# EAGLE design pwerDevPack (EAGLE 8.0.1)
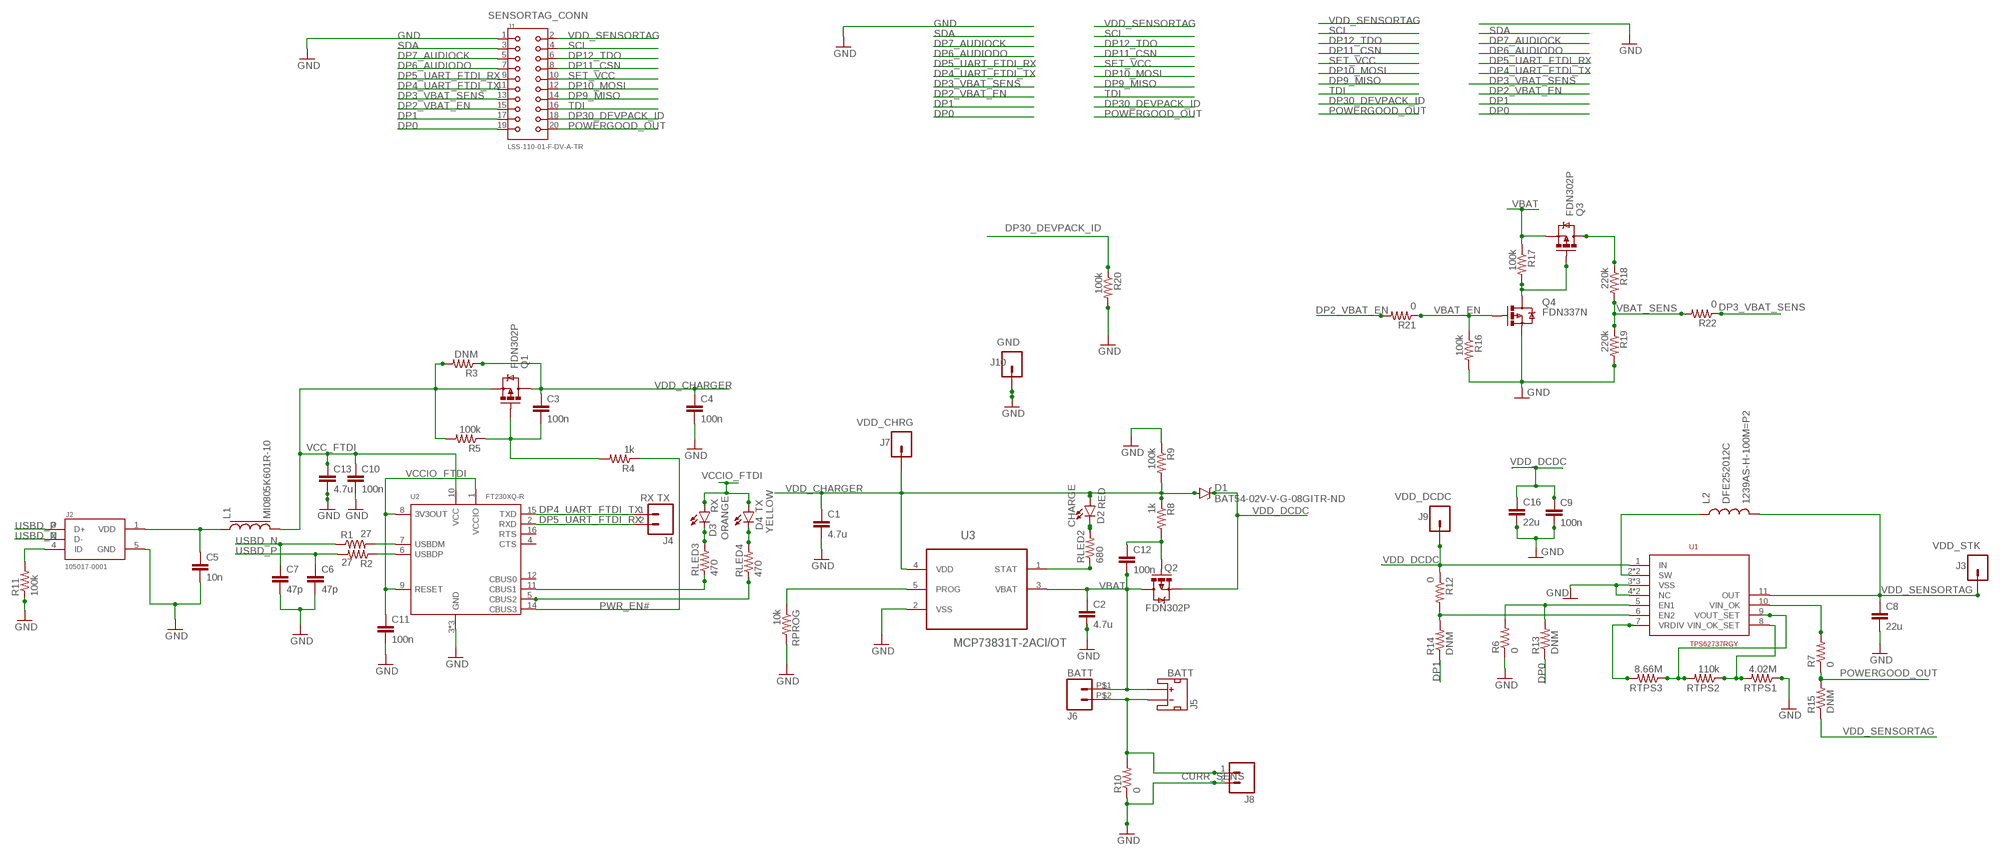
[diagram p0: schematic, sheet 1]

## Parts
C1  4.7u  CAP0603-CAP  [0603-CAP]
C2  4.7u  CAP0603-CAP  [0603-CAP]
C3  100n  CAP0603-CAP  [0603-CAP]
C4  100n  CAP0603-CAP  [0603-CAP]
C5  10n  CAP0603-CAP  [0603-CAP]
C6  47p  CAP0603-CAP  [0603-CAP]
C7  47p  CAP0603-CAP  [0603-CAP]
C8  22u  CAP0603-CAP  [0603-CAP]
C9  100n  CAP0603-CAP  [0603-CAP]
C10  100n  CAP0603-CAP  [0603-CAP]
C11  100n  CAP0603-CAP  [0603-CAP]
C12  100n  CAP0603-CAP  [0603-CAP]
C13  4.7u  CAP0603-CAP  [0603-CAP]
C16  22u  CAP0603-CAP  [0603-CAP]
D1  BAT54-02V-V-G-08GITR-ND  DIODE-SCHOTTKY-BAT54-2V  [SOD-523]
D2  RED  LED0603  [LED-0603]
D3  ORANGE  LED0603  [LED-0603]
D4  YELLOW  LED0603  [LED-0603]
J1  LSS-110-01-F-DV-A-TR  [SAMTEC_LSS-110-01-F-DV-A-TR]
J2  105017-0001  [MOLEX_105017-0001]
J3  M01PTH  [1X01]
J4  M02PTH  [1X02]
J5  S2B-PH-SM4-TB  JST_2MM_MALE  [JST-2-SMD]
J6  M02PTH2  [1X02_BIG]
J7  M01PTH  [1X01]
J8  M02PTH  [1X02]
J9  M01PTH  [1X01]
J10  M01PTH  [1X01]
L1  MI0805K601R-10  FERRITE_BREAD  [0805]
L2  1239AS-H-100M=P2  DFE252012C  [DFE252012C]
Q1  FDN302P  [SOT23-3]
Q2  FDN302P  [SOT23-3]
Q3  FDN302P  [SOT23-3]
Q4  FDN337N  [SOT23-3]
R1  27  RESISTOR0603-RES  [0603-RES]
R2  27  RESISTOR0603-RES  [0603-RES]
R3  DNM  RESISTOR0603-RES  [0603-RES]
R4  1k  RESISTOR0603-RES  [0603-RES]
R5  100k  RESISTOR0603-RES  [0603-RES]
R6  0  RESISTOR0603-RES  [0603-RES]
R7  0  RESISTOR0603-RES  [0603-RES]
R8  1k  RESISTOR0603-RES  [0603-RES]
R9  100k  RESISTOR0603-RES  [0603-RES]
R10  0  RESISTOR0603-RES  [0603-RES]
R11  100k  RESISTOR0603-RES  [0603-RES]
R12  0  RESISTOR0603-RES  [0603-RES]
R13  DNM  RESISTOR0603-RES  [0603-RES]
R14  DNM  RESISTOR0603-RES  [0603-RES]
R15  DNM  RESISTOR0603-RES  [0603-RES]
R16  100k  RESISTOR0603-RES  [0603-RES]
R17  100k  RESISTOR0603-RES  [0603-RES]
R18  220k  RESISTOR0603-RES  [0603-RES]
R19  220k  RESISTOR0603-RES  [0603-RES]
R20  100k  RESISTOR0603-RES  [0603-RES]
R21  0  RESISTOR0603-RES  [0603-RES]
R22  0  RESISTOR0603-RES  [0603-RES]
RLED2  680  RESISTOR0603-RES  [0603-RES]
RLED3  470  RESISTOR0603-RES  [0603-RES]
RLED4  470  RESISTOR0603-RES  [0603-RES]
RPROG  10k  RESISTOR0603-RES  [0603-RES]
RTPS1  4.02M  RESISTOR0603-RES  [0603-RES]
RTPS2  110k  RESISTOR0603-RES  [0603-RES]
RTPS3  8.66M  RESISTOR0603-RES  [0603-RES]
U1  TPS62737RGY  [QFN14]
U2  FT230XQ-R  FT230XQ_2  [QFN16]
U3  MCP73831T-2ACI/OT  [SOT95P280X145-5N]

## Nets
CHARGER_STAT: RLED2.1 U3.1(STAT)
DP0: J1.19 R13.1
DP1: J1.17 R14.1
DP2_VBAT_EN: J1.15 R21.2
DP3_VBAT_SENS: J1.13 R22.1
DP4_UART_FTDI_TX: J1.11 J4.1 U2.15(TXD)
DP5_UART_FTDI_RX: J1.9 J4.2 U2.2(RXD)
DP6_AUDIODO: J1.7
DP7_AUDIOCK: J1.5
DP9_MISO: J1.14
DP10_MOSI: J1.12
DP11_CSN: J1.8
DP12_TDO: J1.6
DP30_DEVPACK_ID: J1.18 R20.1
GND: C1.2 C2.2 C4.2 C5.2 C6.2 C7.2 C8.2 C9.2 C10.2 C11.2 C13.2 C16.2 J1.1 J2.5(GND) J8.2 J10.1 Q4.2(S) R6.1 R9.1 R10.1 R11.1 R16.2 R19.2 R20.2 RPROG.2 RTPS1.1 U1.3(VSS) U1.4(NC) U1.12(VSS) U1.14(NC) U1.TH_PAD(VSS) U2.3(GND) U2.13(GND) U2.17(GND) U3.2(VSS)
GND_BAT: J5.1(-) J6.P$2 J8.1 R10.2
N$1: D3.C RLED3.2
N$2: C5.1 J2.1(VDD) L1.1
N$3: C3.2 Q1.1(G) R4.2 R5.1
N$4: RTPS1.2 RTPS2.1 U1.8(VIN_OK_SET)
N$6: R6.2 R13.2 U1.5(EN1)
N$8: RPROG.1 U3.5(PROG)
N$9: Q3.3(D) R18.1
N$10: R12.2 R14.2 U1.6(EN2)
N$11: L2.P$1 U1.2(SW) U1.13(SW)
N$12: C12.1 Q2.1(G) R8.2
N$13: D2.C RLED2.2
N$14: D4.C RLED4.2
N$15: Q3.1(G) Q4.3(D) R17.2
N$18: J2.4(ID) R11.2
N$20: RLED3.1 U2.11(CBUS1)
N$21: R7.2 U1.10(VIN_OK)
N$22: RTPS3.2 U1.7(VRDIV)
N$24: RLED4.1 U2.5(CBUS2)
N$26: RTPS2.2 RTPS3.1 U1.9(VOUT_SET)
POWERGOOD_OUT: J1.20 R7.1 R15.2
PWR_EN#: R4.1 U2.14(CBUS3)
SCL: J1.4
SDA: J1.3
SET_VCC: J1.10
TDI: J1.16
USBD_N: C7.1 J2.2(D-) R1.1
USBD_P: C6.1 J2.3(D+) R2.2
USBDR_N: R1.2 U2.7(USBDM)
USBDR_P: R2.1 U2.6(USBDP)
VBAT: C2.1 C12.2 J5.2(+) J6.P$1 Q2.3(D) Q3.2(S) R17.1 U3.3(VBAT)
VBAT_EN: Q4.1(G) R16.1 R21.1
VBAT_SENS: R18.2 R19.1 R22.2
VCC_FTDI: C10.1 C13.1 L1.2 Q1.2(S) R3.2 R5.2 U2.10(VCC)
VCCIO_FTDI: C11.1 D3.A D4.A U2.1(VCCIO) U2.8(3V3OUT) U2.9(RESET)
VDD_CHARGER: C1.1 C3.1 C4.1 D1.A D2.A J7.1 Q1.3(D) R3.1 R8.1 R9.2 U3.4(VDD)
VDD_DCDC: C9.1 C16.1 D1.C J9.1 Q2.2(S) R12.1 U1.1(IN)
VDD_SENSORTAG: C8.1 J1.2 J3.1 L2.P$2 R15.1 U1.11(OUT)
Unconnected: J5.NC1(PAD1) J5.NC2(PAD2) U2.4(CTS) U2.12(CBUS0) U2.16(RTS)

## Library data of the parts
C1-C13 C16 = SparkFun-Capacitors:CAP: Capacitor Standard 0603 ceramic capacitor, and 0.1" leaded capacitor.
D1 = SparkFun-DiscreteSemi:DIODE-SCHOTTKY: Schottky diodes in SFE's production catalog BAT20J 1A 23V 0.62Vf RB751 120mA 40V 0.37Vf PMEG4005EJ 0.5A 40V 0.42Vf MBRA140 1A 40V 0.5Vf B340A 3A 40V SMA; VALUE: BAT54-2V
D2 = SparkFun-LED:LED: LEDs Standard schematic elements and footprints for 5mm, 3mm, 1206, and 0603 sized LEDs. 5mm - Spark Fun Electronics SKU : COM-00529 (and others); COLOR: RED; FUNCTION: CHARGE
D3 = SparkFun-LED:LED: LEDs Standard schematic elements and footprints for 5mm, 3mm, 1206, and 0603 sized LEDs. 5mm - Spark Fun Electronics SKU : COM-00529 (and others); COLOR: ORANGE; FUNCTION: RX
D4 = SparkFun-LED:LED: LEDs Standard schematic elements and footprints for 5mm, 3mm, 1206, and 0603 sized LEDs. 5mm - Spark Fun Electronics SKU : COM-00529 (and others); COLOR: YELLOW; FUNCTION: TX
J1 = LSS-110-01-F-DV-A-TR:LSS-110-01-F-DV-A-TR: Conn Socket and Terminal Strip SKT/HDR 20 POS 0.635mm Solder ST SMD T/R; AVAILABILITY: Warning; DESCRIPTION: Conn Socket and Terminal Strip SKT/HDR 20 POS 0.635mm Solder ST SMD T/R; LABEL: SENSORTAG_CONN; MF: Samtec; MP: LSS-110-01-F-DV-A-TR; PACKAGE: None; PRICE: 1.50 USD
J2 = 105017-0001:105017-0001; AVAILABILITY: Good; DESCRIPTION: Conn USB Type B M 5 POS 0.65mm Solder RA Thru-Hole 5 Terminal 1 Port Embossed T/R; MF: Molex; MP: 105017-0001; PACKAGE: None; PRICE: 0.49 USD
J3 = SparkFun-Connectors:M01: Header 1 Standard 1-pin 0.1" header. Use with straight break away headers (SKU : PRT-00116), right angle break away headers (PRT-00553), swiss pins (PRT-00743), machine pins (PRT-00117), and female headers (PRT-00115). SMTSO-256-ET is a "flush mount" nut for a 4-40 screw. The older package used to be too tight, and did not allow it to sit properly thru the drill hit. The latest (0.165DIA) fits nice and snug.; LABEL: VDD_STK
J4 = SparkFun-Connectors:M02: Standard 2-pin 0.1" header. Use with - straight break away headers ( PRT-00116) - right angle break away headers (PRT-00553) - swiss pins (PRT-00743) - machine pins (PRT-00117) - female headers (PRT-00115) Molex polarized connector foot print use with: PRT-08233 with associated crimp pins and housings. 2.54_SCREWTERM for use with PRT-10571. 3.5mm Screw Terminal footprints for PRT-08084 5mm Screw Terminal footprints for use with PRT-08432; LABEL: RX TX
J5 = SparkFun-Connectors:JST_2MM_MALE: Mates to single-cell LiPo batteries. CONN-11443 Now with smashable polarity marks!; BTM_NEG: -; BTM_POS: +; LABEL: BATT; PROD_ID: CONN-11443; TOP_NEG: -; TOP_POS: +
J6 = SparkFun-Connectors:M02: Standard 2-pin 0.1" header. Use with - straight break away headers ( PRT-00116) - right angle break away headers (PRT-00553) - swiss pins (PRT-00743) - machine pins (PRT-00117) - female headers (PRT-00115) Molex polarized connector foot print use with: PRT-08233 with associated crimp pins and housings. 2.54_SCREWTERM for use with PRT-10571. 3.5mm Screw Terminal footprints for PRT-08084 5mm Screw Terminal footprints for use with PRT-08432; LABEL: BATT
J7 = SparkFun-Connectors:M01: Header 1 Standard 1-pin 0.1" header. Use with straight break away headers (SKU : PRT-00116), right angle break away headers (PRT-00553), swiss pins (PRT-00743), machine pins (PRT-00117), and female headers (PRT-00115). SMTSO-256-ET is a "flush mount" nut for a 4-40 screw. The older package used to be too tight, and did not allow it to sit properly thru the drill hit. The latest (0.165DIA) fits nice and snug.; LABEL: VDD_CHRG
J8 = SparkFun-Connectors:M02: Standard 2-pin 0.1" header. Use with - straight break away headers ( PRT-00116) - right angle break away headers (PRT-00553) - swiss pins (PRT-00743) - machine pins (PRT-00117) - female headers (PRT-00115) Molex polarized connector foot print use with: PRT-08233 with associated crimp pins and housings. 2.54_SCREWTERM for use with PRT-10571. 3.5mm Screw Terminal footprints for PRT-08084 5mm Screw Terminal footprints for use with PRT-08432; LABEL: CURR_SENS
J9 = SparkFun-Connectors:M01: Header 1 Standard 1-pin 0.1" header. Use with straight break away headers (SKU : PRT-00116), right angle break away headers (PRT-00553), swiss pins (PRT-00743), machine pins (PRT-00117), and female headers (PRT-00115). SMTSO-256-ET is a "flush mount" nut for a 4-40 screw. The older package used to be too tight, and did not allow it to sit properly thru the drill hit. The latest (0.165DIA) fits nice and snug.; LABEL: VDD_DCDC
J10 = SparkFun-Connectors:M01: Header 1 Standard 1-pin 0.1" header. Use with straight break away headers (SKU : PRT-00116), right angle break away headers (PRT-00553), swiss pins (PRT-00743), machine pins (PRT-00117), and female headers (PRT-00115). SMTSO-256-ET is a "flush mount" nut for a 4-40 screw. The older package used to be too tight, and did not allow it to sit properly thru the drill hit. The latest (0.165DIA) fits nice and snug.; LABEL: GND
L1 = davide:FERRITE_BREAD
L2 = davide:DFE252012C; MODEL: DFE252012C
Q1-Q3 = davide:FDN302P
Q4 = davide:FDN337N
R1-R5 R8-R11 R16-R20 RLED2-RLED4 RPROG = SparkFun-Passives:RESISTOR: Resistor Basic schematic elements and footprints for 0603, 1206, and PTH resistors.
R6 R7 R12-R15 R21 R22 RTPS1-RTPS3 = SparkFun-Resistors:RESISTOR: Resistor Basic schematic elements and footprints for 0603, 1206, and PTH resistors.
U1 = davide:TPS62737RGY
U2 = FT230XQ:FT230XQ_2
U3 = MCP73831T-2ACI_OT:MCP73831T-2ACI/OT: Charge Management Controller; AVAILABILITY: Good; DESCRIPTION: MCP73831 Series Single-Cell Li-Ion/Li-Polymer Battery Charge Controller SOT-23-5; MF: Microchip; MP: MCP73831T-2ACI/OT; PACKAGE: SOT-23 Microchip; PRICE: 0.51 USD

## Board
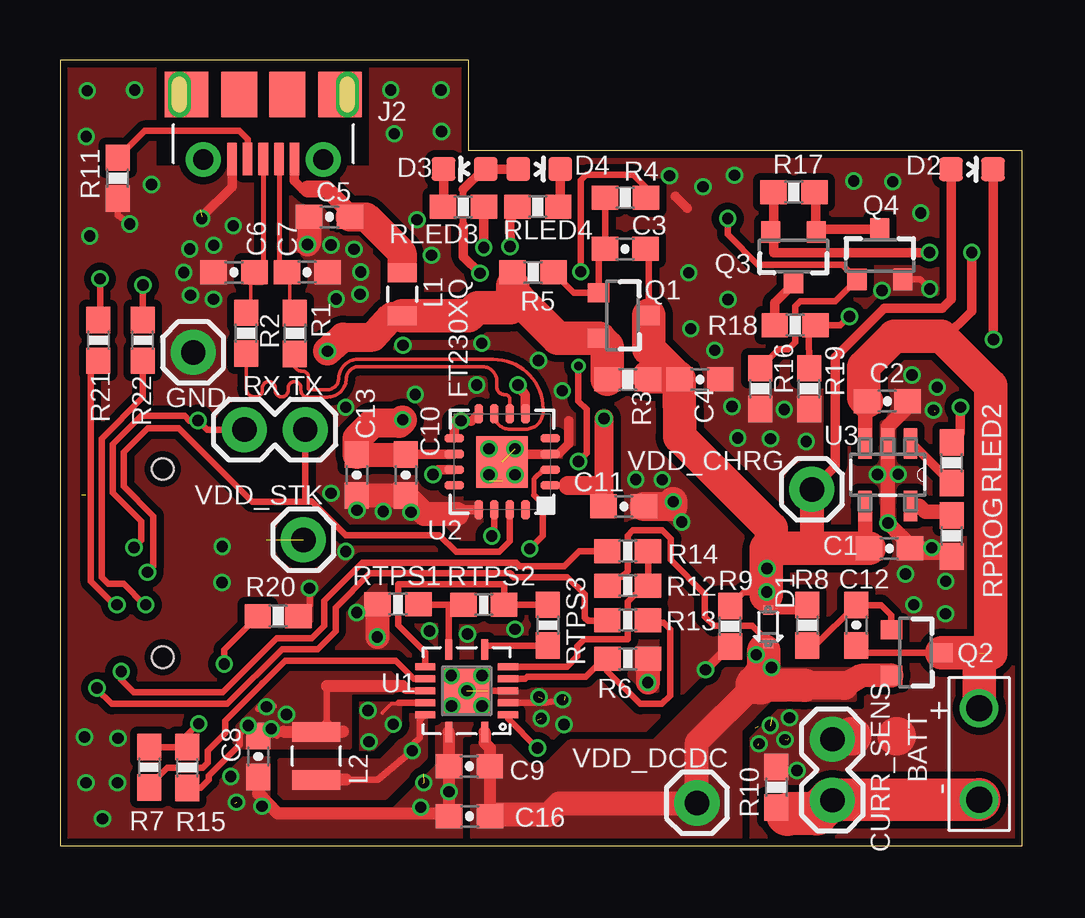
[diagram p1: board, top side]
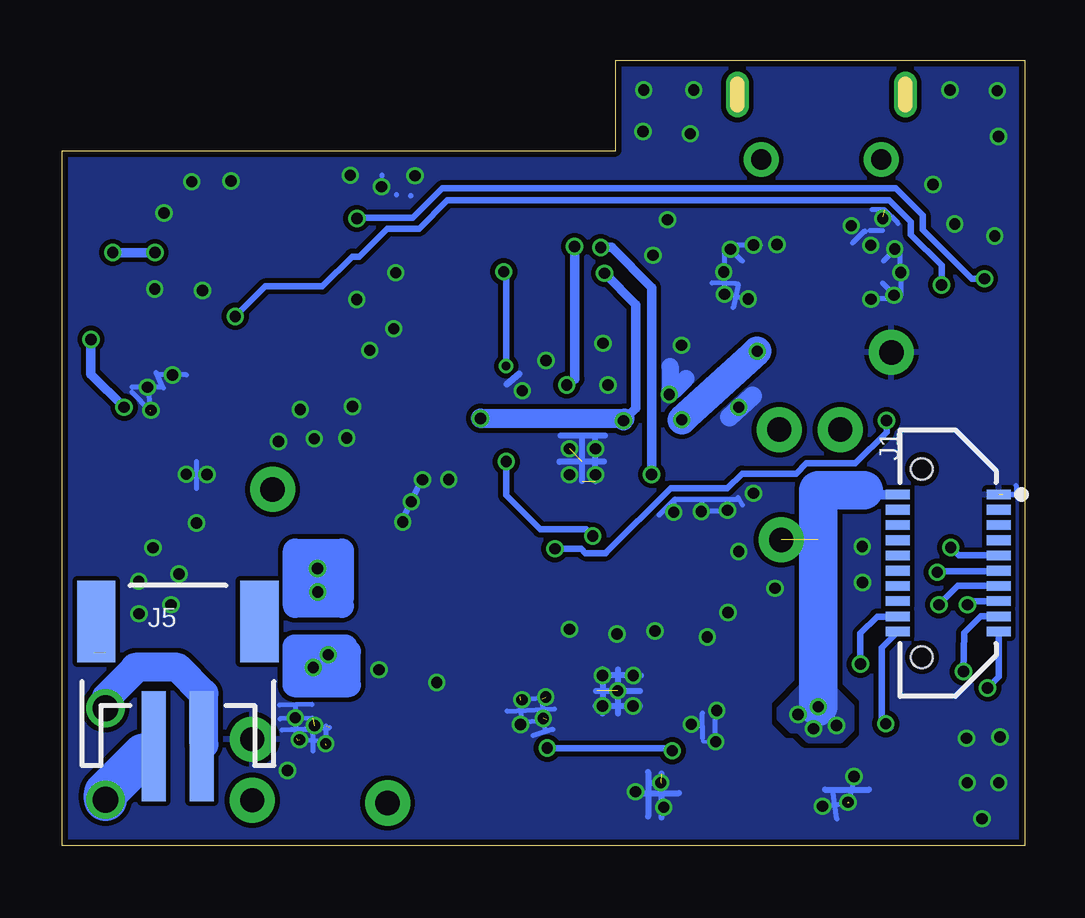
[diagram p2: board, bottom side, seen from below]

Size 40.09 x 32.74 mm. Coordinates in mm from the lower left corner, seen from the top.
Outline: 0,0 40.09,0 40.09,28.97 17.03,28.97 17.03,32.74 0,32.74 0,0
Copper layers (1*16): Top 0.018mm / dielectric 1.55mm / Bottom 0.018mm
Design rules "eC_2Layer_PClass6_BaseCopperO18_eCDefault": minimum track width 0.15mm, minimum drill 0.35mm, track to track 0.15mm, track to pad 0.15mm, pad to pad 0.15mm, via to via 0.15mm, smd to smd 0mil, copper to edge 0.25mm, drill to drill 0.35mm, minimum pad ring 0.175mm, minimum via ring 0.125mm, stop-mask expansion 0mil, vias tented up to drill 0.45mm, thermal gap 0.2mm

### Footprints (pad centres in the part's own frame; a part is rotated, then mirrored left to right if it is on the bottom)
0603-CAP = smd 1.1 x 1: 1 -0.85,0; 2 0.85,0
SOD-523 = smd 0.4 x 0.4: A -0.7,0; C 0.7,0
LED-0603 = smd 1 x 1: A 0,-0.877; C 0,0.877
SAMTEC_LSS-110-01-F-DV-A-TR = smd 0.4 x 1: 1 -2.857,2.1; 2 -2.857,-2.1; 3 -2.223,2.1; 4 -2.223,-2.1; 5 -1.587,2.1; 6 -1.587,-2.1; 7 -0.953,2.1; 8 -0.953,-2.1; 9 -0.318,2.1; 10 -0.318,-2.1; 11 0.318,2.1; 12 0.318,-2.1; 13 0.953,2.1; 14 0.953,-2.1; 15 1.587,2.1; 16 1.587,-2.1; 17 2.223,2.1; 18 2.223,-2.1; 19 2.857,2.1; 20 2.857,-2.1 | hole 0.89: 3.925,-1.1; -3.925,-1.1
MOLEX_105017-0001 = smd 0.4 x 1.35: 1 -1.3,2.675; 2 -0.65,2.675; 3 0,2.675; 4 0.65,2.675; 5 1.3,2.675 | drill 0.85 pad 1.45: P$1 -2.5,2.7; P$2 2.5,2.7 | smd 1.5 x 1.9: P$8 -1,0; P$9 1,0 | smd 1.8 x 1.9: P$10 -3.2,0; P$11 3.2,0 | drill 0.6 pad 0.9 long: P$12 -3.5,0; P$13 3.5,0
1X01 = drill 1.016 pad 1.88: 1 0,0
1X02 = drill 1.016 pad 1.88: 1 0,0; 2 2.54,0
JST-2-SMD = smd 1 x 4.6: 1 -1,-3.7; 2 1,-3.7 | smd 1.6 x 3.4: NC1 -3.4,1.5; NC2 3.4,1.5
1X02_BIG = drill 1.067: P$1 0,0; P$2 3.81,0
0805 = smd 0.8 x 1.2: 1 -0.9,0; 2 0.9,0
DFE252012C = smd 0.8 x 2: P$1 -1,0; P$2 1,0
SOT23-3 = smd 0.8 x 0.9: 1 -0.95,-1; 2 0.95,-1; 3 0,1.1
0603-RES = smd 1.1 x 1: 1 -0.85,0; 2 0.85,0
QFN14 = smd 0.85 x 0.28: 1 -1.725,-0.75; 7 1.725,-0.75; 8 1.725,0.75; 14 -1.725,0.75 | smd 0.28 x 0.85: 2 -1,-1.725; 3 -0.5,-1.725; 4 0,-1.725; 5 0.5,-1.725; 6 1,-1.725; 9 1,1.725; 10 0.5,1.725; 11 0,1.725; 12 -0.5,1.725; 13 -1,1.725 | smd 2 x 2: TH_PAD 0,0
QFN16 = smd 0.8 x 0.35: 1 -2,0.975; 2 -2,0.325; 3 -2,-0.325; 4 -2,-0.975; 9 2,-0.975; 10 2,-0.325; 11 2,0.325; 12 2,0.975 | smd 0.35 x 0.8: 5 -0.975,-2; 6 -0.325,-2; 7 0.325,-2; 8 0.975,-2; 13 0.975,2; 14 0.325,2; 15 -0.325,2; 16 -0.975,2 | smd 2.15 x 2.15: 17 0,0
SOT95P280X145-5N = smd 1.27 x 0.559: 1 -1.295,0.94; 2 -1.295,0; 3 -1.295,-0.94; 4 1.295,-0.94; 5 1.295,0.94

### Placement (x,y rotation side)
C1  34.56,12.39 0 top
C2  34.47,18.52 0 top
C3  23.55,24.87 180 top
C4  26.66,19.43 0 top
C5  11.23,26.21 180 top
C6  7.25,23.9 180 top
C7  10.3,23.9 0 top
C8  8.26,3.72 270 top
C9  17.05,3.31 180 top
C10  14.41,15.45 270 top
C11  23.49,14.14 0 top
C12  33.18,9.19 270 top
C13  12.37,15.45 270 top
C16  17.07,1.23 180 top
D1  29.51,9.13 270 top
D2  38,28.19 270 top
D3  16.86,28.2 90 top
D4  19.97,28.2 270 top
J1  3.18,11.78 270 bottom
J2  8.47,31.3 180 top
J3  10.14,12.75 0 top
J4  10.22,17.34 180 top
J5  35.28,7.85 0 bottom
J6  38.3,5.73 270 top
J7  31.33,14.85 0 top
J8  32.18,1.9 90 top
J9  26.54,1.78 90 top
J10  5.55,20.56 0 top
L1  14.26,22.98 270 top
L2  10.68,3.74 90 top
Q1  23.44,22.1 270 top
Q2  35.64,8.05 270 top
Q3  30.56,24.57 180 top
Q4  34.16,24.6 0 top
R1  9.79,21.35 270 top
R2  7.76,21.36 90 top
R3  23.65,19.43 180 top
R4  23.56,27.01 180 top
R5  19.71,23.9 180 top
R6  23.66,7.79 180 top
R7  3.71,3.27 270 top
R8  31.14,9.19 270 top
R9  27.92,9.15 90 top
R10  29.85,2.44 270 top
R11  2.41,27.82 90 top
R12  23.66,10.84 0 top
R13  23.65,9.4 0 top
R14  23.65,12.28 0 top
R15  5.31,3.26 90 top
R16  29.17,19.05 270 top
R17  30.58,27.24 0 top
R18  30.63,21.69 0 top
R19  31.21,19.05 270 top
R20  9.09,9.57 0 top
R21  1.6,21.06 270 top
R22  3.45,21.06 90 top
RLED2  37.15,15.96 90 top
RLED3  16.81,26.63 180 top
RLED4  19.91,26.63 0 top
RPROG  37.15,12.91 270 top
RTPS1  14.09,10.06 0 top
RTPS2  17.66,10.04 0 top
RTPS3  20.33,9.2 270 top
U1  16.95,6.46 90 top
U2  18.42,16 180 top
U3  34.49,15.46 270 top

### Tracks (layer width: path | path; a pad name or v marks a point on that pad's centre or on a via)
CHARGER_STAT
  Top 0.27: U3.1 35.48,16.81 35.48,16.78
  Top 0.4: 35.48,16.78 RLED2.1
DP0  (via drill 0.47)
  Top 0.27: R13.1 22.77,9.37 22,9.37 21.86,9.51 21.86,10.48 21.14,11.2 18.9,11.2 18.75,11.35 12.91,11.35 11.48,9.92 11.48,8.94 10.74,8.2 9.25,8.2 6.96,5.91 2.16,5.91 1.54,6.53 v1.54,6.58
  Bottom 0.27: J1.19 1.08,7.04 v1.54,6.58
DP1  (via drill 0.47)
  Top 0.27: R14.1 21.63,12.28 21,11.65 19.15,11.65 19,11.8 12.59,11.8 11,10.21 11,9.16 10.48,8.64 9.04,8.64 6.79,6.39 3.08,6.39 2.55,6.92 v2.55,7.26
  Bottom 0.27: v2.55,7.26 2.52,8.87 1.83,9.56 J1.17
DP2_VBAT_EN  (via drill 0.47)
  Top 0.27: R21.2 1.6,20.11 1.29,19.8 1.29,11.02 2.27,10.04 v2.38,10.04
  Bottom 0.27: J1.15 2.23,10.19 v2.38,10.04
DP3_VBAT_SENS  (via drill 0.47)
  Top 0.27: v3.57,10.04 3.52,10.04 2.65,10.91 2.01,10.91 1.73,11.19 1.73,16.96 3.45,18.68 R22.1
  Bottom 0.27: J1.13 2.78,10.83 v3.57,10.04
DP4_UART_FTDI_TX  (via drill 0.47)
  Top 0.27: U2.15 18.75,12.69 18.31,12.25 16.5,12.25 15.8,12.95 11.9,12.95 10.51,14.34 10.43,14.34 | 10.22,14.34 10.43,14.34 | 10.44,14.35 10.43,14.34 | v3.64,11.4 3.89,11.65 3.89,13.74 2.65,14.98 2.65,16.39 3.66,17.4 4.95,17.4 8.01,14.34 10.1,14.34 10.22,14.34 | J4.1 10.22,14.34
  Bottom 0.27: J1.11 1.11,11.43 3.61,11.43 v3.64,11.4
DP5_UART_FTDI_RX  (via drill 0.47)
  Top 0.2: 19.77,14.6 19.77,15.31 20.14,15.68
  Top 0.27: v3.08,12.43 3.39,12.74 3.39,13.53 2.2,14.72 2.2,16.73 3.38,17.91 5.2,17.91 5.39,17.72 v5.75,17.72 6.13,17.34 J4.2 | v19.57,12.38 20.11,12.92 20.11,14.26 19.77,14.6 | 20.14,15.68 U2.2
  Bottom 0.27: v3.08,12.43 2.75,12.1 J1.9 | v19.57,12.38 18.48,12.38 18.3,12.2 17.46,12.2 17.43,12.23 14.75,14.89 12.39,14.89 11.77,15.51 9.51,15.51 9.09,15.93 7.06,15.93 5.75,17.24 v5.75,17.72
DP30_DEVPACK_ID  (via drill 0.47)
  Top 0.27: v6.84,7.57 6.84,8.17 R20.1
  Bottom 0.27: J1.18 5.65,9.56 5.66,9.55 6.14,9.55 6.84,8.85 v6.84,7.57
GND  (via drill 0.47)  (20 unrouted)
  Top 0.15: U1.12 15.18,5.92 13.8,5.92 13.42,5.54 13.42,5.53
  Top 0.27: U1.4 17.82,6.46 arc90 17.81,6.46 | U1.3 20.23,5.96 v20.93,6.08 | R11.1 2.41,26.27 v2.91,25.91 | v36.24,23.2 35.84,23.6 Q4.2 | R20.2 10.4,10.03 v10.4,10.73 | U1.12 14.12,5.96
  Top 0.4: J2.5 7.17,27.47 5.91,26.21 v5.91,26.14 | v26.9,7.34 27.86,8.3 R9.1 | 16.55,13.83 16.72,14 U2.13 | U2.3 19.18,16.32 v18.96,16.54 | 26.14,26.56 25.63,27.07 | 25.16,15.32 v25.09,15.25 | 20.81,16.36 21.2,16.75 21.2,17.71
  Top 0.5: U1.14 16.2,1.25 C16.2 16.07,1.35 9.06,1.35 8.26,2.19 C8.2
  Top 0.6: C2.2 35.32,18.29 34.49,17.46 U3.2 34.49,13.47 35.41,12.55 C1.2 35.88,12.39 36.05,12.22 36.99,12.22 RPROG.2
  Top 1: v13.22,8.7 13.23,8.71 RTPS1.1 | v24.49,6.8 24.51,6.82 R6.1 | C13.2 C10.2 15.18,13.83 16.55,13.83 | C5.2 10.38,25.12 v10.31,25.05
  Top 1.2: C11.2 25.55,14.14 v25.55,14.34
  Top 1.6: 34.87,4.56 34.86,4.57 | 33,4.57 32.99,4.56
  Bottom 0.15: 13.41,4.5 arc1 13.41,4.36 13.38,4.33 v12.87,4.33 | v13.88,5.07 13.83,5.01 13.64,5.01
  Bottom 0.2: 0.35,15.01 0.35,14.62 0.9,14.62 | 5.17,23.94 5.17,24.89 5.19,24.91 | 5.16,23.87 5.16,22.96 5.14,22.94 | v5.4,24.88 5.4,24.84 5.88,24.36 | 5.27,25.93 5.85,26.51 6.36,26.51 | 5.91,25.63 6.42,25.63 6.43,25.64 | 6.62,25.6 6.68,25.6 7.16,25.12 | 11.93,23.4 12.14,22.42 | 12.52,24.85 12.52,22.99 12.55,22.96 | 11.76,24.36 v12.26,24.86 | 5.47,22.91 5.47,23 5.91,23.44 | 26.78,27.95 26.77,27.91 | 25.56,27.1 25.59,27.07 | 26.16,27.12 26.17,27.13 | 29.68,5.31 29.65,3.94 | 29.1,4.18 29.1,4.99 | 19.65,4.85 20.49,4.59 | 12.88,4.52 12.89,5.55 | 7.03,3 v7.37,1.8 | 7.3,1.78 8.51,1.61 | 7.82,1.12 7.99,2.33 | 34.92,19.62 36.09,19.62 | 36.01,19.11 37.18,19.11 | 35.88,19.07 36.19,19.73 | 36.51,19.22 36.45,18.11 | 36.43,18.12 37.18,18.9 | 19.7,6.19 21.01,6.07 | 15.24,13.78 14.64,14.38 | 14.64,14.38 14.57,14.45 11.94,14.45 | 14.64,14.38 14.61,14.35 14.61,13.82 | 12.34,13.98 12.37,13.95 13.51,13.95 | 12.39,14.43 12.38,14.42 12.38,13.92 | 13.46,14.43 13.46,13.84 | 11.75,14.2 11.94,14.52 | 11,25.02 12.17,25.02 | 5.45,22.79 6.62,22.79 | 11.56,22.78 12.54,22.99 | 12.04,23.42 13.03,23.46 | 19.97,4.82 20.09,6.13 | 20.91,4.9 21.03,6.21 | 21.21,5.13 19.9,5.25 | 21.56,5.61 19.59,5.71 | 13.57,5.01 13.64,5.01 | 29.03,4.35 30.31,4.39 | 29.66,5.32 31.03,5.29 | 29.68,5.89 31.05,5.86 | 30.34,4.48 30.37,5.85 | 30.55,4.85 28.96,4.92 | 30.94,4.83 29.57,4.86 | 33.98,15.46 35.12,15.46 | 34.5,14.88 34.5,16.02 | 13.41,4.5 13.42,5.53
  Bottom 0.25: 17.53,16.01 19.37,16.01 19.37,16 | 18.43,15.2 18.43,17.04 | 19.33,17.1 17.49,17.1 | 17.86,6.46 16.02,6.46 | 16.95,7.35 16.95,5.51 | 15.99,7.1 17.83,7.1 | 16.03,5.82 17.87,5.82 | 16.24,2.2 14.4,2.2 | 15.13,3.01 15.13,1.17 | 15.68,3.07 15.68,1.23 | 15.12,2.61 15.67,2.61 | 8.32,2.34 6.48,2.34 | 17.88,15.18 17.88,17.02 | 17.58,7.36 17.58,5.52 | 25.1,15.32 26,13.42
  Bottom 0.27: 21.06,19.67 21.57,19.23
  Bottom 0.7: 14.77,19.98 14.77,18.97 14.6,18.97 14.1,19.47
  Bottom 0.8: 12.3,17.86 11.33,18.75
  other vias: 7.22,25.84 16.3,7.1 17.59,7.1 16.31,5.83 17.59,5.82 12.83,5.64 15.04,1.6 15.16,2.63 16.21,2.25 7.11,2.89 8.42,1.65 21,5.05 20.05,5.31 36.32,12.42 35.23,11.32 36.91,11.02 35.5,19.62 36.55,19.11 36.4,18.15 17.88,16.54 18.96,15.46 17.88,15.46 11.29,25.03 12.53,23.91 12.5,22.98 11.51,22.78 6.4,22.77 5.44,22.94 5.16,23.89 6.41,25.02 26.79,27.46 25.4,27.92 11.29,14.69 12.38,13.98 13.47,13.93 14.62,13.9 25.91,13.49 3.81,27.55 29.6,16.96 19.95,6.2 6.76,12.47 6.75,10.97 1.02,4.53 2.42,4.48 1.08,2.63 2.39,2.63 1.77,1.13 1.14,31.46 3.11,31.49 13.78,31.49 15.87,31.49 15.9,29.76 13.93,29.67 1.24,25.41 34.25,23.14 33.07,27.7 34.7,27.67 35.86,26.37 28.1,27.94 36.9,9.67 35.57,10.04 1.09,29.55 23.99,15.26 11.91,12.26 15.4,8.95 18.96,9.02 16.98,8.83 16.95,6.46 11.91,18.27 30.39,5.34 29.59,5.01 29.12,4.25 30.21,4.42 30.71,3.14 34.06,15.47 34.5,13.45 31.09,16.85 15.48,24.61 14.88,26.09 34.93,15.48 19.94,20.22 20.93,18.96 26.2,23.88 27.83,22.76 27.28,20.65 30.18,18.18 28,18.3 26.28,21.54 28.24,16.99 17.36,19.2 14.8,18.81 17.57,20.94 14.29,20.86 12.36,9.72
  pour Bottom (isolate 0.2, rank 6): 0.21,32.6 16.9,32.6 16.9,28.8 39.9,28.8 39.9,0.1 0.14,0.01
  pour Top (no thermals): 10.13,24.52 10.78,24.52 10.78,22.64 10.78,22.56 11.09,22.25 12.46,22.25 12.94,22.73 12.94,23.4 13.13,23.59 13.13,24.32 12.95,24.5 12.95,24.89 12.53,25.31 11.74,25.31 11.54,25.51 9.97,25.51 9.96,25.52
  pour Top (isolate 0.3, no thermals): 25.63,25.87 25.63,26.32 25.21,26.32 26.74,26.35 26.74,25.89 25.85,25.89
  cutout Top: 17.44,14.4 20.02,14.4 20.02,17.04 20.02,17.6 17.44,17.6 16.82,17.6 16.82,16.32 16.82,14.4 17.48,14.4
  cutout Top: 15.64,7.76 18.24,7.76 18.24,5.16 15.64,5.16
  pour Top (isolate 0.3, rank 3, no thermals): 0.75,32.42 16.69,32.42 16.69,28.8 16.69,28.61 39.74,28.61 39.74,0.36 0.35,0.36 0.35,32.42 0.72,32.42
GND_BAT
  Top 0.2: 30.31,1.31 30.13,1.31 R10.2
  Top 1.8: J6.P$2 J8.1 32.11,1.92 31.52,1.33 30.33,1.33 30.31,1.31
  Bottom 0.2: 36.71,3.79 36.64,3.79 J5.1
  Bottom 1.8: J6.P$2 38.3,2.2 36.71,3.79
N$1
  Top 0.4: D3.C 15.98,26.65 RLED3.2
N$2
  Top 0.4: J2.1 9.77,27.71 10.12,27.36 10.33,27.36 | 14.26,24.34 L1.1 14.26,23.83
  Top 0.7: 10.33,27.36 11.11,27.36 12.08,26.39 C5.1
  Top 1.2: C5.1 12.76,26.21 14.26,24.71 14.26,24.34
N$3
  Top 0.27: Q1.1 22.7,23.31 | Q1.1 22.44,24.61 C3.2 R4.2 | Q1.1 21.41,23.05 R5.1
N$4
  Top 0.27: RTPS2.1 16.29,10.04 | 16.29,10.04 14.96,10.04 arc-90 RTPS1.2 | U1.8 16.2,9.95 arc-90 16.29,10.04
N$6
  Top 0.27: 22.59,7.91 R6.2 | R6.2 22.81,7.28 24.18,5.91 25.08,5.91 25.42,6.25 25.42,9.03 25.15,9.3 24.6,9.3 R13.2 24.68,9.37 | R6.2 22.42,7.53 22.39,7.53 21.9,7.04 19.47,7.04 19.39,6.96 U1.5
N$8
  Top 0.6: U3.5 35.8,14.16 36.05,13.91 37,13.91 RPROG.1
N$9
  Top 0.4: Q3.3 30.56,23.43 30.57,23.42 29.78,22.63 R18.1
N$10
  Top 0.27: U1.6 21.13,7.46 21.56,7.89 21.56,8.32 21.84,8.6 23.66,8.6 23.66,10.16 24.34,10.84 R12.2 | R14.2 R12.2 | 24.5,10.79 R12.2
N$11  (via drill 0.47)
  Top 0.27: U1.13 14.98,5.22 14.98,4.5 14.74,4.26 v14.68,3.96 13.23,2.75 11.91,2.75 | U1.2 18.67,5.29 v19.89,4.07
  Top 0.5: 11.91,2.75 10.38,2.75
  Bottom 0.27: v19.89,4.07 14.55,4.07 v14.68,3.96
  pour Top (isolate 0.3, rank 2, no thermals): 15.21,5.5 15.21,3.68 13.53,2 9.16,2 9.16,3.56 12.82,3.56 12.82,3.55 13.4,3.55 14.66,4.81 14.66,5.5
N$12
  Top 0.27: Q2.1 34.64,9.6 34.21,10.03 33.16,10.03 C12.1 31.45,8.34 R8.2
N$13  (via drill 0.47)
  Top 0.27: RLED2.2 37.52,17.18
  Top 0.4: 37.52,17.18 v37.52,18.27 | 39.14,27.93 D2.C 38.88,21.12 v38.9,21.1
  Bottom 0.4: v37.52,18.27 38.9,19.65 v38.9,21.1
N$14
  Top 0.27: RLED4.2 20.43,26.67
  Top 0.4: RLED4.2 20.85,26.72 D4.C
N$15
  Top 0.4: R17.2 31.48,27.19 31.48,25.54 Q3.1 31.64,25.7 Q4.3
N$17
  cutout Top: 13.37,23.34 15.16,23.34 15.14,22.72 13.35,22.72
N$18
  Top 0.27: J2.4 7.82,29.44 7.47,29.79 3.53,29.79 R11.2
N$19
  cutout Top: 4.04,32.45 4.04,28.35 12.86,28.35 12.86,32.45
N$20  (via drill 0.47)
  Top 0.4: U2.11 15.74,15.68 v15.54,15.47 | RLED3.1 v17.66,24.93
  Bottom 0.4: v17.66,24.93 17.21,24.93 15.54,23.26 v15.54,15.47
N$21
  Top 0.27: 8.44,6.78 8.43,6.78 | 8.44,6.78 6.88,5.22 6.88,4.69 6.15,3.96 6.15,3.47 5.94,3.26 4.47,3.26 3.85,2.65 R7.2 | U1.10 14.74,6.96 13.98,7.72 9.38,7.72 8.44,6.78
N$22
  Top 0.27: 20.17,8.19 arc90 RTPS3.2 17.7,8.35 U1.7
N$24  (via drill 0.47)
  Top 0.4: v18.75,24.97 18.74,26 RLED4.1 | v19.08,19.2 19.39,18.79 U2.5
  Bottom 0.4: v18.75,24.97 18.74,19.44 v19.08,19.2
N$26
  Top 0.27: RTPS3.1 RTPS2.2 | RTPS2.2 arc90 RTPS2.2 18.5,10.9 14.09,10.9 14.09,9.2 15.22,8.07 U1.9 | RTPS2.2 18.51,10.11
POWERGOOD_OUT  (via drill 0.47)
  Top 0.27: R7.1 3.86,4.11 R15.2 5.31,4.63 v5.78,5.09
  Bottom 0.27: J1.20 5.95,8.25 5.95,5.28 5.59,4.92 v5.78,5.09
PWR_EN#  (via drill 0.35, 0.47)
  Top 0.27: R4.1 24.41,27.43 23.88,27.96 21.93,27.96 21.7,27.73 v21.7,23.92 | v17.99,12.91 18.09,13.02 U2.14 | v21.6,16.01 21.95,16.36 21.95,18.18 21.6,18.53 v21.6,19.99
  Bottom 0.27: v17.99,12.91 18.26,13.18 20.18,13.18 21.6,14.6 v21.6,16.01 | v21.6,19.99 21.6,23.82 v21.7,23.92
USBD_N
  Top 0.15: 9.57,23.78 9.57,22.42 R1.1
  Top 0.2: 9.12,23.9 C7.1 9.57,23.78 | J2.2 9.13,24.22
  Top 0.406: J2.2 | 9.13,24.22 C7.1
USBD_P
  Top 0.15: 7.95,23.49 7.95,22.4 R2.2
  Top 0.2: C6.1 8.47,24.27 J2.3 | 7.85,23.59 7.95,23.49
  Top 0.27: 7.85,23.65 8.41,23.65
  Top 0.4: 7.85,23.65 C6.1
  Top 0.406: 7.85,23.65 7.85,23.59 8.46,23.59
USBDR_N
  Top 0.15: U2.7 arc90 18.73,17.36 19.4,17.36 arc90 20.13,18.09 20.13,18.21 arc90 18.05,20.27 12.47,20.27 arc90 11.61,19.49 arc-90 11.14,19 10.42,19 arc-90 10.35,19.06 10.35,19.55 arc90 10.07,19.78 arc-90 9.73,20.12 R1.2
USBDR_P
  Top 0.15: U2.6 18.75,18.59 arc90 18.53,18.8 arc-90 18.2,19.13 18.2,19.36 arc90 17.57,19.97 12.47,19.97 arc90 11.93,19.46 arc-90 11.15,18.7 arc-90 11.14,18.7 10.3,18.7 arc-90 10.04,18.97 10.04,19.08 arc90 9.78,19.34 9.77,19.34 arc90 9.51,19.08 9.51,18.97 arc-90 9.24,18.71 9.23,18.71 arc-90 8.97,18.97 8.97,19.08 arc90 8.71,19.34 8.7,19.34 arc90 8.43,19.08 8.43,18.97 arc-90 8.17,18.71 8.11,18.71 arc-90 7.76,19.06 R2.1
VBAT  (via drill 0.47)  (1 unrouted)
  Top 0.27: Q2.3 33.15,8.05 C12.2
  Top 0.4: R17.1 29.73,25.69 | 29.73,25.69 Q3.2 | 36.83,21.12 37.99,22.28 v37.99,24.72 | 29.73,25.69 29.73,24.72 v36.23,24.72
  Top 0.6: U3.3 33.55,18.52 C2.1
  Top 1.4: C2.1 33.48,18.66 33.48,19.96 34.75,21.23 36.72,21.23 36.83,21.12 38.78,19.17 38.79,8.02 | Q2.3 38.3,8.04 J6.P$1
  Bottom 0.2: 34.2,4.23 J5.2
  Bottom 0.4: v36.23,24.72 v37.99,24.72
  Bottom 1.2: 34.2,4.23 34.2,6.34 35.29,7.43 37.06,7.43 37.06,7.38 38.25,6.19 J6.P$1
VBAT_EN  (via drill 0.47)
  Top 0.27: R21.1 1.71,21.9 1.67,21.94 v1.67,23.63 | v27.82,26.14 27.82,25.48 29.08,24.22 32.59,24.22 Q4.1 32.31,22.7 30.85,22.7 30.63,22.48 30.63,20.99 30.34,20.7 29.95,20.7 R16.1
  Bottom 0.27: v27.82,26.14 27.8,26.16 25.5,26.16 24.26,27.4 5.37,27.4 4.25,26.28 4.25,25.67 2.21,23.63 v1.67,23.63
VBAT_SENS  (via drill 0.47)
  Top 0.27: v32.89,22.06 32.52,21.69 R18.2 31.2,21.41 R19.1 | R22.2 v3.45,23.36 v3.46,23.37
  Bottom 0.27: v32.89,22.06 31.64,23.31 29.26,23.31 28.02,24.55 27.72,24.55 26.55,25.72 25.23,25.72 24.05,26.9 5.64,26.9 4.74,26 4.74,25.46 3.46,24.18 v3.46,23.37
VCC_FTDI  (via drill 0.47)
  Top 0.4: C10.1 14.44,16.32 U2.10 | 18.86,23.33 R5.2
  Top 1: C13.1 C10.1
  Top 1.2: 12.37,16.48 C13.1 12.37,16.97 13,17.6 14.13,17.6 v14.28,17.75 | v11.14,20.61 11.8,21.19 13.04,21.19 13.83,22.06 L1.2
  Top 1.4: Q1.2 20.73,21.15 19.11,22.77 | 19.11,22.77 18.86,23.02 18.86,23.33 | L1.2 17.01,22.08 17.41,22.42 18.77,22.42 19.11,22.77 | Q1.2 22.46,21.15 | Q1.2 22.8,20.79 R3.2
  Bottom 1.2: v11.14,20.61 v14.28,17.75
VCCIO_FTDI  (via drill 0.47)
  Top 0.3: U2.1 21.16,15.03 21.16,15.02 | 16.81,25.86 16.81,27.36
  Top 0.4: 17.36,17.92 U2.8 17.14,17.7 v16.71,17.71 16.42,17.72 U2.9 | D4.A D3.A | v17.5,23.86 16.81,24.55 16.81,25.86 | 17.74,28.19 D3.A | 16.81,27.36 17.65,28.2 D3.A
  Top 0.8: C11.1 22.67,14.17 22.67,15.04 | 22.67,15.04 v22.67,17.81 | 21.16,15.02 22.65,15.02 22.67,15.04
  Bottom 0.4: v17.5,23.86 16.19,22.55 16.19,18.23 v16.71,17.71
  Bottom 0.8: 16.65,17.81 v16.71,17.71 16.66,17.82 v22.66,17.82 v22.67,17.81
VDD_CHARGER  (via drill 0.47)
  Top 0.2: R3.1 24.54,19.54
  Top 0.27: 31.36,10.04 R8.1 31.14,9.97 | C3.1 24.54,24.73 Q1.3 | R9.2 28.49,10.57 v29.45,10.57 29.43,10.55 29.43,10.53
  Top 0.4: 29.43,10.43 29.43,9.82 D1.A 30.93,9.83 arc90 R8.1 | D2.A 37.13,22.77 36.76,22.4 34.34,22.4 32.3,20.36 32.3,15.82 J7.1
  Top 0.6: U3.4 33.55,12.55 C1.1
  Top 1: J7.1 31.33,12.41 31.35,12.39
  Top 1.4: 29.43,10.43 29.43,10.53 29.43,12.39 29.63,12.39 | 29.63,12.39 31.35,12.39 C1.1 | 29.63,12.39 29.63,13.23 25.82,17.04 C4.1 | Q1.3 24.54,20.72 C4.1 | 24.54,19.54 25.72,19.54 C4.1
  Bottom 1: 28.45,10 30.4,10 30.4,12.3 28.45,12.3 28.45,10.35 28.55,10.45 28.55,10.55 28.57,10.57 v29.45,10.57
  Bottom 1.4: v29.46,11.56 v29.45,11.55 v29.45,10.57
VDD_DCDC  (via drill 0.47)
  Top 0.27: R12.1 23.18,11.21 23.41,11.21 23.65,11.45 23.65,12.92 23.87,13.14 25.1,13.14 25.45,12.79 25.45,11.91 26.87,10.49 26.87,9.54 27.25,9.16 28.84,9.16 29.51,8.49 D1.C 29.52,8.4 29.32,8.13 | v29.01,7.96 29.03,7.94 29.32,7.94 | v29.64,7.43 29.6,7.39 29.32,7.39
  Top 0.5: U1.1 17.7,4.29 17.91,4.08 C16.1
  Top 1: Q2.2 33.38,7.08 32.67,6.67 | J9.1 26.54,4.32 28.92,6.7 28.94,6.68 29.2,6.68 29.23,6.68 29.25,6.7 | 26.67,1.76 20.81,1.76 20.34,1.29 17.98,1.29 C16.1
  Top 1.2: 32.67,6.67 31,6.68
  Top 1.4: 31,6.68 29.23,6.72 | 29.32,8.13 29.32,7.94 29.32,7.39 28.95,6.72
  Top 1.6: 29.23,6.72 28.95,6.72 29.2,6.68
  Bottom 1: 28.3,8.3 30.42,8.3 30.42,6.7 28.15,6.7 28.15,8.1 29.1,8.1 29.1,7.4 29.05,7.4 29.05,7.35 29.72,7.35 | 29.75,7.55 29.75,7.35 29.72,7.35 | 29.72,7.35 v29.64,7.43
  pour Top (isolate 0.3, rank 2, no thermals): 33.06,7.33 27.75,7.33 24.75,4.33 21.23,4.33 20.25,3.35 19.52,3.35 18.74,4.13 17.18,4.13 17.18,0.37 28.34,0.37 28.34,4.86 29.58,6.1 33.1,6.1 33.12,6.12 33.12,7.32
VDD_SENSORTAG  (via drill 0.47)  (1 unrouted)
  Top 0.2: C8.1 9.04,4.58 9.04,4.64 v8.8,4.88 | 7.49,4.58 7.49,4.66 v7.84,5.01
  Top 0.27: R15.1 5.86,2.41 6.2,2.75 6.2,2.92 7.49,4.21 7.49,4.58 | U1.11 15.29,6.46 15.29,6.47 14.4,6.47 14.4,6.51 | 8.26,5.71 8.56,5.75 | 8.56,5.75 8.9,5.8 | 9.31,4.75 9.21,4.75 9.04,4.58 | 11.12,6.65 11.12,5.18 | 11.12,5.18 L2.P$2 | v8.6,5.79 | v8.6,5.79 8.56,5.75 | 11.79,4.75 11.54,4.75 11.12,5.18
  Top 0.35: 14.4,6.51 14.27,6.65
  Top 0.5: 9.31,4.75 11.79,4.75 | 14.27,6.65 11.12,6.65
  Bottom 0.4: J1.2 6.3,14.64 6.71,14.82
  Bottom 1.6: 6.71,14.82 8.59,14.82 8.59,12.75 v8.59,5.8 v8.6,5.79
  other vias: 9.44,5.47
  pour Bottom (isolate 0.3, no thermals): 8.16,6.78 9.17,6.78 10.25,5.7 10.25,5.32 9.72,4.79 9.42,4.79 9.01,4.38 7.65,4.38 7.18,4.85 7.18,5.8
  pour Top (isolate 0.3, rank 2, no thermals): 14.62,6.54 14.61,6.54 13.85,7.3 9.52,7.3 7.27,5.05 7.27,4.35 7.5,4.12 12.07,4.11 12.07,6.4 14.62,6.41